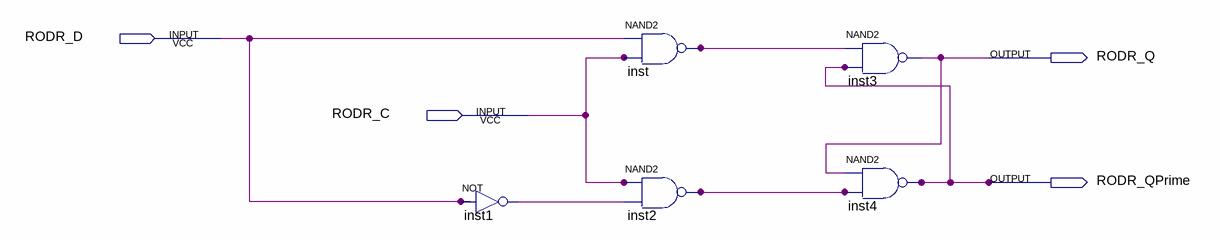
[diagram p0: schematic sheet]
// Quartus schematic RODR_DLatch.bdf as structural Verilog: 5 symbols, 4 pins
module RODR_DLatch (
  input  RODR_D,
  input  RODR_C,
  output RODR_Q,
  output RODR_QPrime
);

  wire inst1_out, inst2_out, inst_out;

  not inst1 (inst1_out, RODR_D);
  nand inst (inst_out, RODR_D, RODR_C);
  nand inst2 (inst2_out, RODR_C, inst1_out);
  nand inst3 (RODR_Q, inst_out, RODR_QPrime);
  nand inst4 (RODR_QPrime, RODR_Q, inst2_out);
endmodule
